# EAGLE schematic module_CKP_Hall (EAGLE 9.2.0)
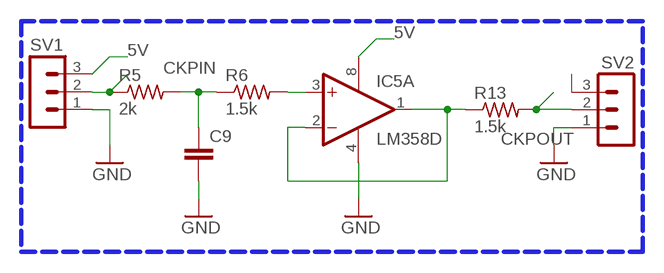
[diagram p0: schematic, sheet 1]

## Parts
C9  C-EU025-025X050  [C025-025X050]
IC5  LM358D  [SO08]
R5  2k  R-US_0204/5  [0204/5]
R6  1.5k  R-US_0204/5  [0204/5]
R13  1.5k  R-US_0204/5  [0204/5]
SV1  MA03-1  [MA03-1]
SV2  MA03-1  [MA03-1]

## Nets
5V: IC5.8(P:V+) SV1.3
CKPIN: R5.1 SV1.2
CKPOUT: R13.2 SV2.2
CPKOUT: IC5.1(A:OUT) IC5.2(A:-IN) R13.1
GND: C9.2 IC5.4(P:V-) SV1.1 SV2.1
N$2: SV2.3
N$5: IC5.3(A:+IN) R6.2
N$6: C9.1 R5.2 R6.1
Unconnected: IC5.5(B:+IN) IC5.6(B:-IN) IC5.7(B:OUT)

## Library data of the parts
C9 = rcl:C-EU: CAPACITOR, European symbol; SPICEPREFIX: C
IC5 = linear:LM358: OP AMP also LM158; LM258; LM2904 Source: http://cache.national.com/ds/LM/LM158.pdf
R5 R6 R13 = rcl:R-US_: RESISTOR, American symbol; SPICEPREFIX: R
SV1 SV2 = con-lstb:MA03-1: PIN HEADER; OC_FARNELL: unknown; OC_NEWARK: unknown